# Altium schematic sheet nguyen li.SchDoc
size A
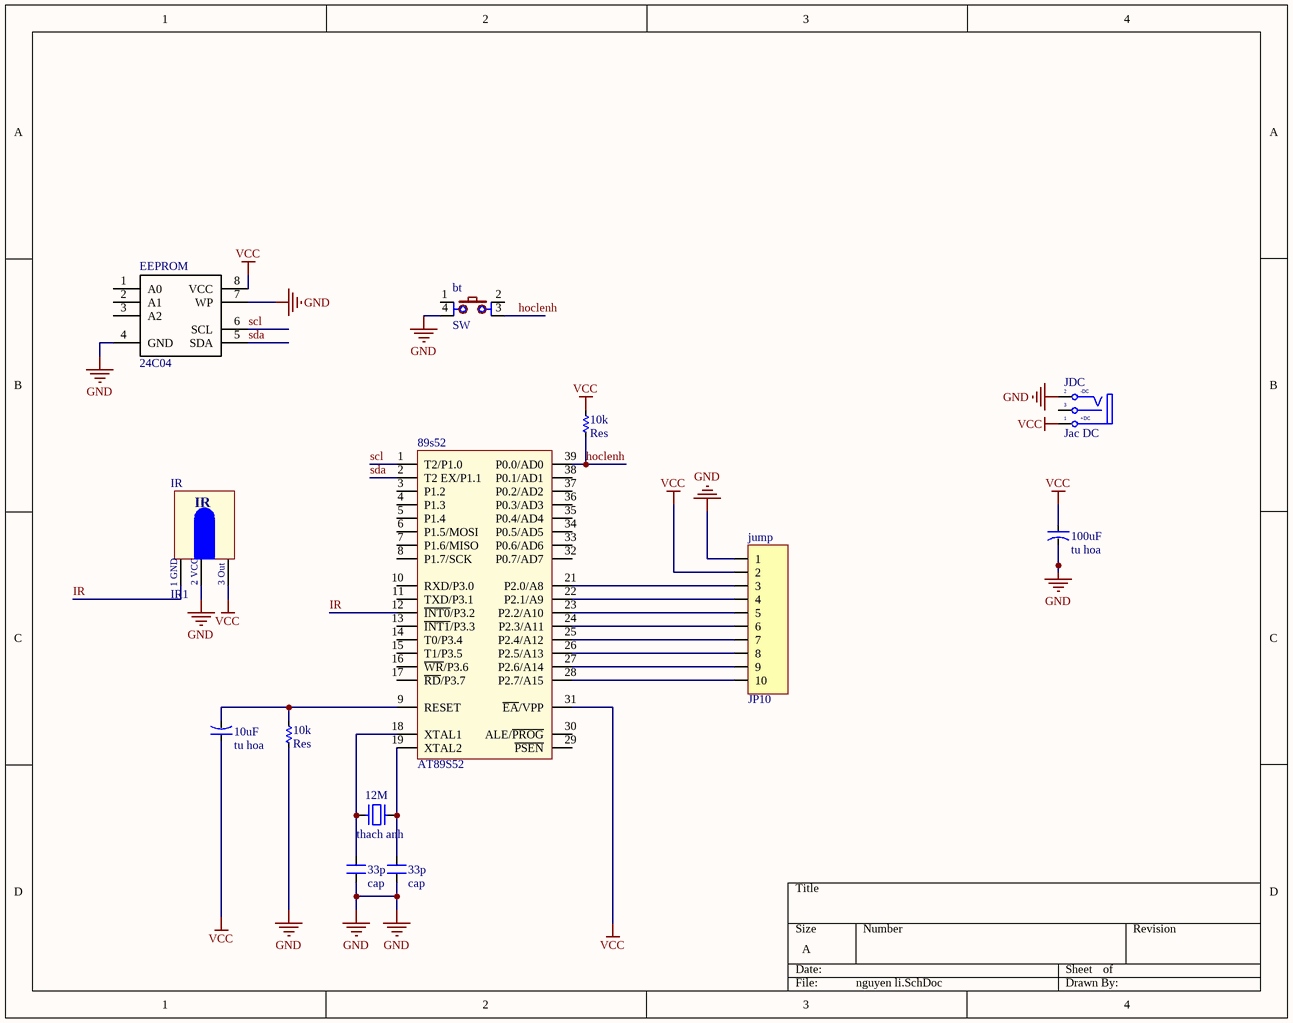
[diagram p0: nguyen li.SchDoc]

## Parts
(Parts that share a designator on the sheet are numbered #1, #2 ... from top to bottom, then left to right.)
10k#1  Res  [RES-SMD-0805]
10k#2  Res  [RES-1/4W]
10uF  tu hoa  [CA-ALU-5W]
12M  thach anh  [XT2]
33p#1  cap  [CN1]
33p#2  cap  [CN1]
89s52  AT89S52  [DIP40/W0.6]
100uF  tu hoa  [CA-ALU-5W]
bt  SW  [SW2-DIP]
EEPROM  24C04  [DIP8]
IR  IR1  [IR2]
JDC  Jac DC  [DC-IN]
jump  JP10  [JP10-D1T]

## Nets
GND: 10k#2.2 33p#1.1 33p#2.1 89s52.20(GND) 100uF.2 bt.4 EEPROM.4(GND) EEPROM.7(WP) IR.2(GND) JDC.2(TN) jump.1
VCC: 10k#1.1 10uF.1 89s52.31(~{EA}/VPP) 89s52.40(VCC) 100uF.1 EEPROM.8(VCC) IR.3(VCC) JDC.1(T) jump.2
hoclenh: 10k#1.2 89s52.39(P0.0/AD0) bt.3
IR: 89s52.12(~{INT0}/P3.2) IR.1(Out)
scl: 89s52.1(T2/P1.0) EEPROM.6(SCL)
sda: 89s52.2(T2_EX/P1.1) EEPROM.5(SDA)
Net10k#2_1: 10k#2.1 10uF.2 89s52.9(RESET)
Net12M_1: 12M.1 33p#2.2 89s52.19(XTAL2)
Net12M_2: 12M.2 33p#1.2 89s52.18(XTAL1)
Net89s52_21: 89s52.21(P2.0/A8) jump.3
Net89s52_22: 89s52.22(P2.1/A9) jump.4
Net89s52_23: 89s52.23(P2.2/A10) jump.5
Net89s52_24: 89s52.24(P2.3/A11) jump.6
Net89s52_25: 89s52.25(P2.4/A12) jump.7
Net89s52_26: 89s52.26(P2.5/A13) jump.8
Net89s52_27: 89s52.27(P2.6/A14) jump.9
Net89s52_28: 89s52.28(P2.7/A15) jump.10

Not connected (* = marked no-connect by the designer): 89s52 3(P1.2) 4(P1.3) 5(P1.4) 6(P1.5/MOSI) 7(P1.6/MISO) 8(P1.7/SCK) 10(RXD/P3.0) 11(TXD/P3.1) 13(~{INT1}/P3.3) 14(T0/P3.4) 15(T1/P3.5) 16(~{WR}/P3.6) 17(~{RD}/P3.7) 29(~{PSEN}) 30(ALE/~{PROG}) 32(P0.7/AD7) 33(P0.6/AD6) 34(P0.5/AD5) 35(P0.4/AD4) 36(P0.3/AD3) 37(P0.2/AD2) 38(P0.1/AD1); bt 1 2; EEPROM 1(A0) 2(A1) 3(A2); JDC 3(S)

## Notes on the sheet
- (in symbol DCIN) -DC; +DC
- (in symbol IR1) 1 GND; 2 VCC; 3 Out

## Library data of the parts
10k#1 = Res-SMD: Resistor; Manufacturer: Generic Components; Class: Passive; Published: 08/06/2000; Publisher: Altium Hobart Technology Centre
10k#2 = Res: Manufacturer: Generic Components; Class: Passive; SubClass: R; Published: 08/06/2000; Publisher: Altium Hobart Technology Centre
10uF 100uF = CN-ALU-DIP: Capacitor (Semiconductor SIM Model); Value: 104; LatestRevisionDate: 17-Jul-2002; LatestRevisionNote: Re-released for DXP Platform.; PackageReference: C1206; Publisher: Altium Limited
12M = XT2: Crystal, 32.768 KHz, -40 to 85 degC, 3.2 x 1.5 x 0.9 mm SMD; Value: 4Mhz
33p#1 33p#2 = CN1: Cap np  1pF - 472pF; Value: 100pF
89s52 = AT89S52: AT89S52, 8k Byte Flash Memory , 40 Pin; Value: AT89S52
bt = SW4: Switch button 4 pin; Value: Button chip 4 pin
EEPROM = 24Cxx: Standard 2-Wire Bus Interface Serial EEPROM; Value: 24Cxx; Value: DIP 8; Copyright by: VanDungEvn
IR = IR1: Receiver Infraed IC
JDC = DCIN: Jac DC input; Value: Jac DC
jump = JP10: WR-PHD 2.54 mm Angled Socket Header; Manufacturer: W¨¹rth Elektronik eiSos GmbH; partNo: 613010143121; ComponentLink1 Description: Manufacturer; ComponentLink2 Description: Datasheet; NoPins: 10; Created Date: 29 March 2013; ComponentLink1URL: http://www.we-online.com; ComponentLink2URL: http://katalog.we-online.de/em/datasheet/6130xx143121.pdf; Created by: Karrer Zheng